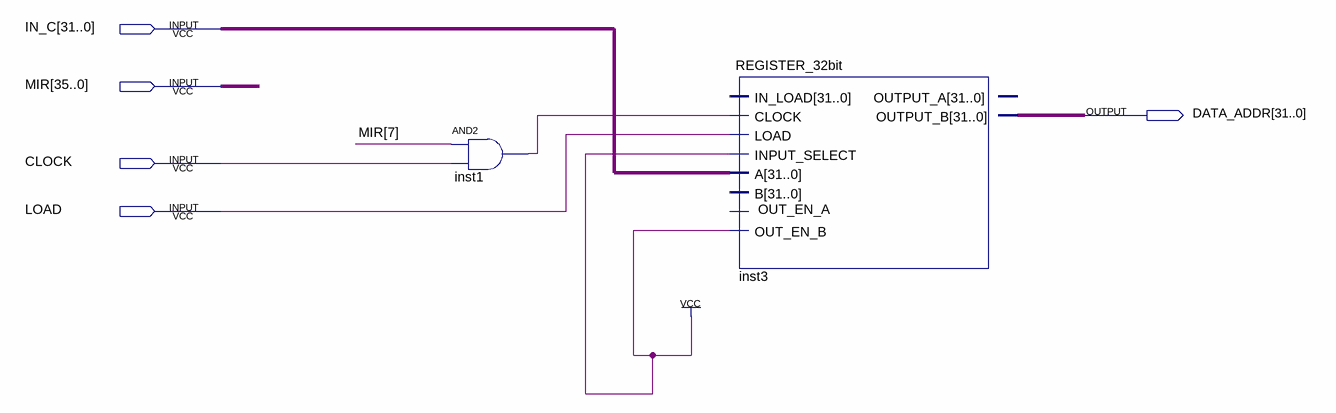
[diagram p0: schematic sheet]
// Quartus schematic MAR.bdf as structural Verilog: 2 symbols, 5 pins
module MAR (
  input  [31:0] IN_C,
  input  [35:0] MIR,
  input  CLOCK,
  input  LOAD,
  output [31:0] DATA_ADDR
);

  wire inst1_out;

  and inst1 (inst1_out, MIR[7], CLOCK);
  REGISTER_32bit inst3 (
    .LOAD(LOAD), .CLOCK(inst1_out), .OUT_EN_B(1'b1), .INPUT_SELECT(1'b1), .A(IN_C), .OUTPUT_B(DATA_ADDR));  // open: OUT_EN_A, IN_LOAD, B, OUTPUT_A
endmodule
